# EasyEDA Pro project 遥控器PCB设计.eprj, schematic 接收器
Board Name: 接收器; Create Date: 2025-03-09; Page Name: P1; Project Name: 遥控器接收端; Schematic Name: 接收器; Update Date: 2025-03-12; Company: 嘉立创EDA; Page Size: A4; Version: V1.0
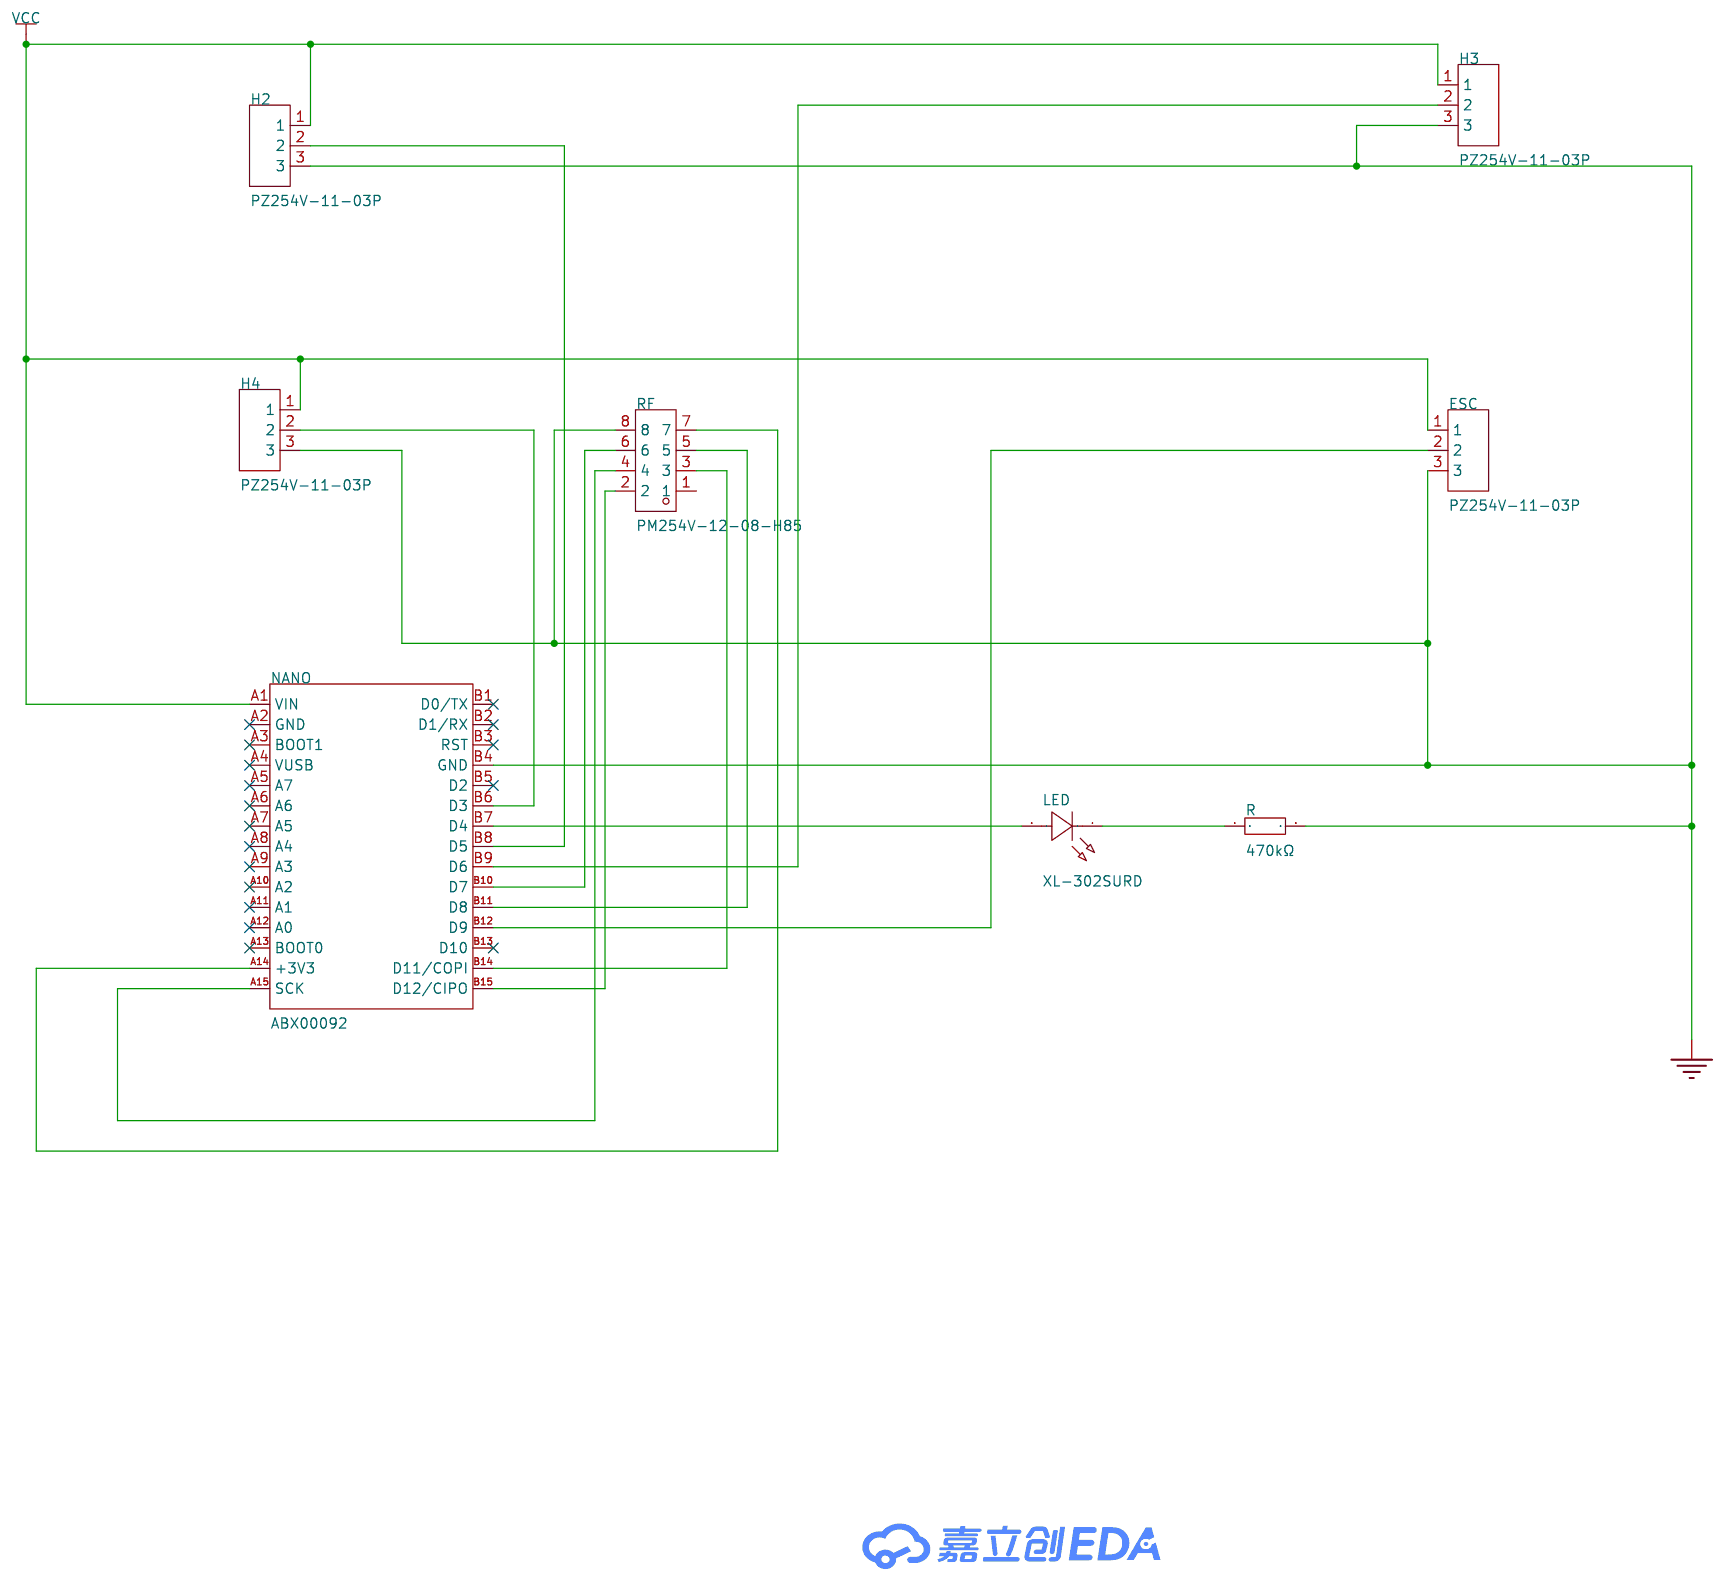
[diagram p0: schematic sheet]

## Parts
ESC  PZ254V-11-03P  [HDR-TH_3P-P2.54-V-M]
H2  PZ254V-11-03P  [HDR-TH_3P-P2.54-V-M]
H3  PZ254V-11-03P  [HDR-TH_3P-P2.54-V-M]
H4  PZ254V-11-03P  [HDR-TH_3P-P2.54-V-M]
LED  XL-302SURD  [LED-TH_BD3.8-P2.54-RD]
NANO  ABX00092  [COMM-TH_ABX00092]
R  470kΩ  [RES-TH_BD3.3-L9.0-P13.00-D0.6]
RF  PM254V-12-08-H85  [HDR-TH_8P-P2.54-V-F-R2-C4-S2.54]

## Library data of the parts
ESC H2-H4 = PZ254V-11-03P: 插针结构:1x3P;间距:2.54mm;行距:-;圆针/方针:方针;安装方式:直插;排数:单排;总PIN位数:3P;额定电流:3A;额定电压:250V;配合针长度:6mm;塑高:2.5mm;端接针长度:3mm;工作温度:-40℃~+105℃;颜色:黑色;; LCSC Part Name: 1x3P 间距:2.54mm 方针 直插; Supplier Part: C2937625; Manufacturer: XFCN(兴飞); Supplier Footprint: 插件,P=2.54mm; JLCPCB Part Class: 扩展库; Datasheet: https://atta.szlcsc.com/upload/public/pdf/source/20200309/C492402_8335C3D49C4E4C618838D59BB1D024C1.pdf; Supplier: LCSC; Pin Structure: 1x3P; Pitch: 2.54mm; Circluar Pins/Square Pins: 方针; Mounting Type: 直插; Number of Rows: 单排; Number of Pins: 3P; Current Rating: 3A; Voltage Rating (Max): 250V; Length of Mating Pin: 6mm; Insulation Height: 2.5mm; Length of End Connection Pin: 3mm; Operating Temperature: -40℃~+105℃; Color: 黑色
LED = XL-302SURD: 灯头类型:3mm圆形灯头;发光颜色:红色;功率:80mW;正向电流:30mA;主波长:615nm~620nm;透镜颜色:红色透镜;色温:-;发光角度:50°;载带方式:-;工作温度:-25℃~+85℃;; Supplier Part: C2895470; Manufacturer: XINGLIGHT(成兴光); Supplier Footprint: 插件,D=3mm; JLCPCB Part Class: 扩展库; Datasheet: https://atta.szlcsc.com/upload/public/pdf/source/20240112/E1E2B82945FD635E4907401DDE6D4922.pdf; Supplier: LCSC; Lamp Holder Type: 3mm圆形灯头; Emitted Color: 红色; Power Dissipation: 80mW; Forward Current: 30mA; Dominant Wavelength: 615nm~620nm; Peak Wavelength: 625nm; Lens Color: 红色透镜; Viewing Angle: 50°; Operating Temperature: -25℃~+85℃
NANO = ABX00092: Supplier Part: C22392566; Manufacturer: arduino; JLCPCB Part Class: 扩展库; Datasheet: https://atta.szlcsc.com/upload/public/pdf/source/20240508/B4DB31292A327EFF3440EB84C8D7CAB2.pdf; Supplier: LCSC
R = MFR0S2F4703A20: 电阻类型:金属膜电阻;阻值:470kΩ;精度:±1%;功率:500mW;温度系数:±50ppm/℃;; LCSC Part Name: 470kΩ ±1% 500mW 金属膜电阻 小体积,铜脚，圆柱状直插; Supplier Part: C81750; Manufacturer: UNI-ROYAL(厚声); Supplier Footprint: 插件,D2.7xL9mm; JLCPCB Part Class: 扩展库; Datasheet: https://atta.szlcsc.com/upload/public/pdf/source/20180326/C81750_FEF507EC32A27FEECA9118CB077A57C5.pdf; Supplier: LCSC; Type: 金属膜电阻; Tolerance: ±1%; Voltage-Supply(Max): 250V; Power(Watts): 500mW; Temperature Coefficient: ±50ppm/℃
RF = PM254V-12-08-H85: 插孔结构:2x4P;间距:2.54mm;行距:2.54mm;圆孔/方孔:方孔;安装类型:直插;排数:双排;总孔位数:8P;额定电流:3A;额定电压:250V;插孔方向:顶部;塑高:8.5mm;工作温度范围:-40℃~+105℃;; LCSC Part Name: 间距:2.54mm 2x4P 直插; Supplier Part: C2834799; Manufacturer: XFCN(兴飞); Supplier Footprint: 插件,P=2.54mm; JLCPCB Part Class: 扩展库; Datasheet: https://atta.szlcsc.com/upload/public/pdf/source/20200309/C492399_8C441E2934FBB604A89B37A68AA45ECF.pdf; Supplier: LCSC; Holes Structure: 2x4P; Pitch: 2.54mm; Row Spacing: 2.54mm; Circular Hole / Square Hole: 方孔; Mounting Type: 直插; Number of Rows: 双排; Number of Holes: 8P; Current Rating (Max): 3A; Voltage Rating (Max): 250V; Holes Direction: 顶部; Insulation Height: 8.5mm; Operating Temperature Range: -40℃~+105℃

## Nets
GND: ESC.3 H2.3 H3.3 H4.3 NANO.B4(GND) R.2 RF.8
VCC: ESC.1 H2.1 H3.1 H4.1 NANO.A1(VIN)
$1N1503: ESC.2 NANO.B12(D9)
$1N2948: H4.2 NANO.B6(D3)
$1N2957: H2.2 NANO.B8(D5)
$1N2965: H3.2 NANO.B9(D6)
$1N3034: LED.2(A) NANO.B7(D4)
$1N3514: LED.1(K) R.1
Net-(NANO-A14): NANO.A14(+3V3) RF.7
Net-(NANO-A15): NANO.A15(SCK) RF.4
Net-(NANO-B10): NANO.B10(D7) RF.6
Net-(NANO-B11): NANO.B11(D8) RF.5
Net-(NANO-B14): NANO.B14(D11/COPI) RF.3
Net-(NANO-B15): NANO.B15(D12/CIPO) RF.2

Not connected (* = marked no-connect by the designer): NANO A2(GND)* A3(BOOT1)* A4(VUSB)* A5(A7)* A6* A7(A5)* A8(A4)* A9(A3)* A10(A2)* A11(A1)* A12(A0)* A13(BOOT0)* B1(D0/TX)* B2(D1/RX)* B3(RST)* B5(D2)* B13(D10)*; RF 1
